# EAGLE schematic usb_tester_OLED_128x64 (EAGLE 6.5.0)
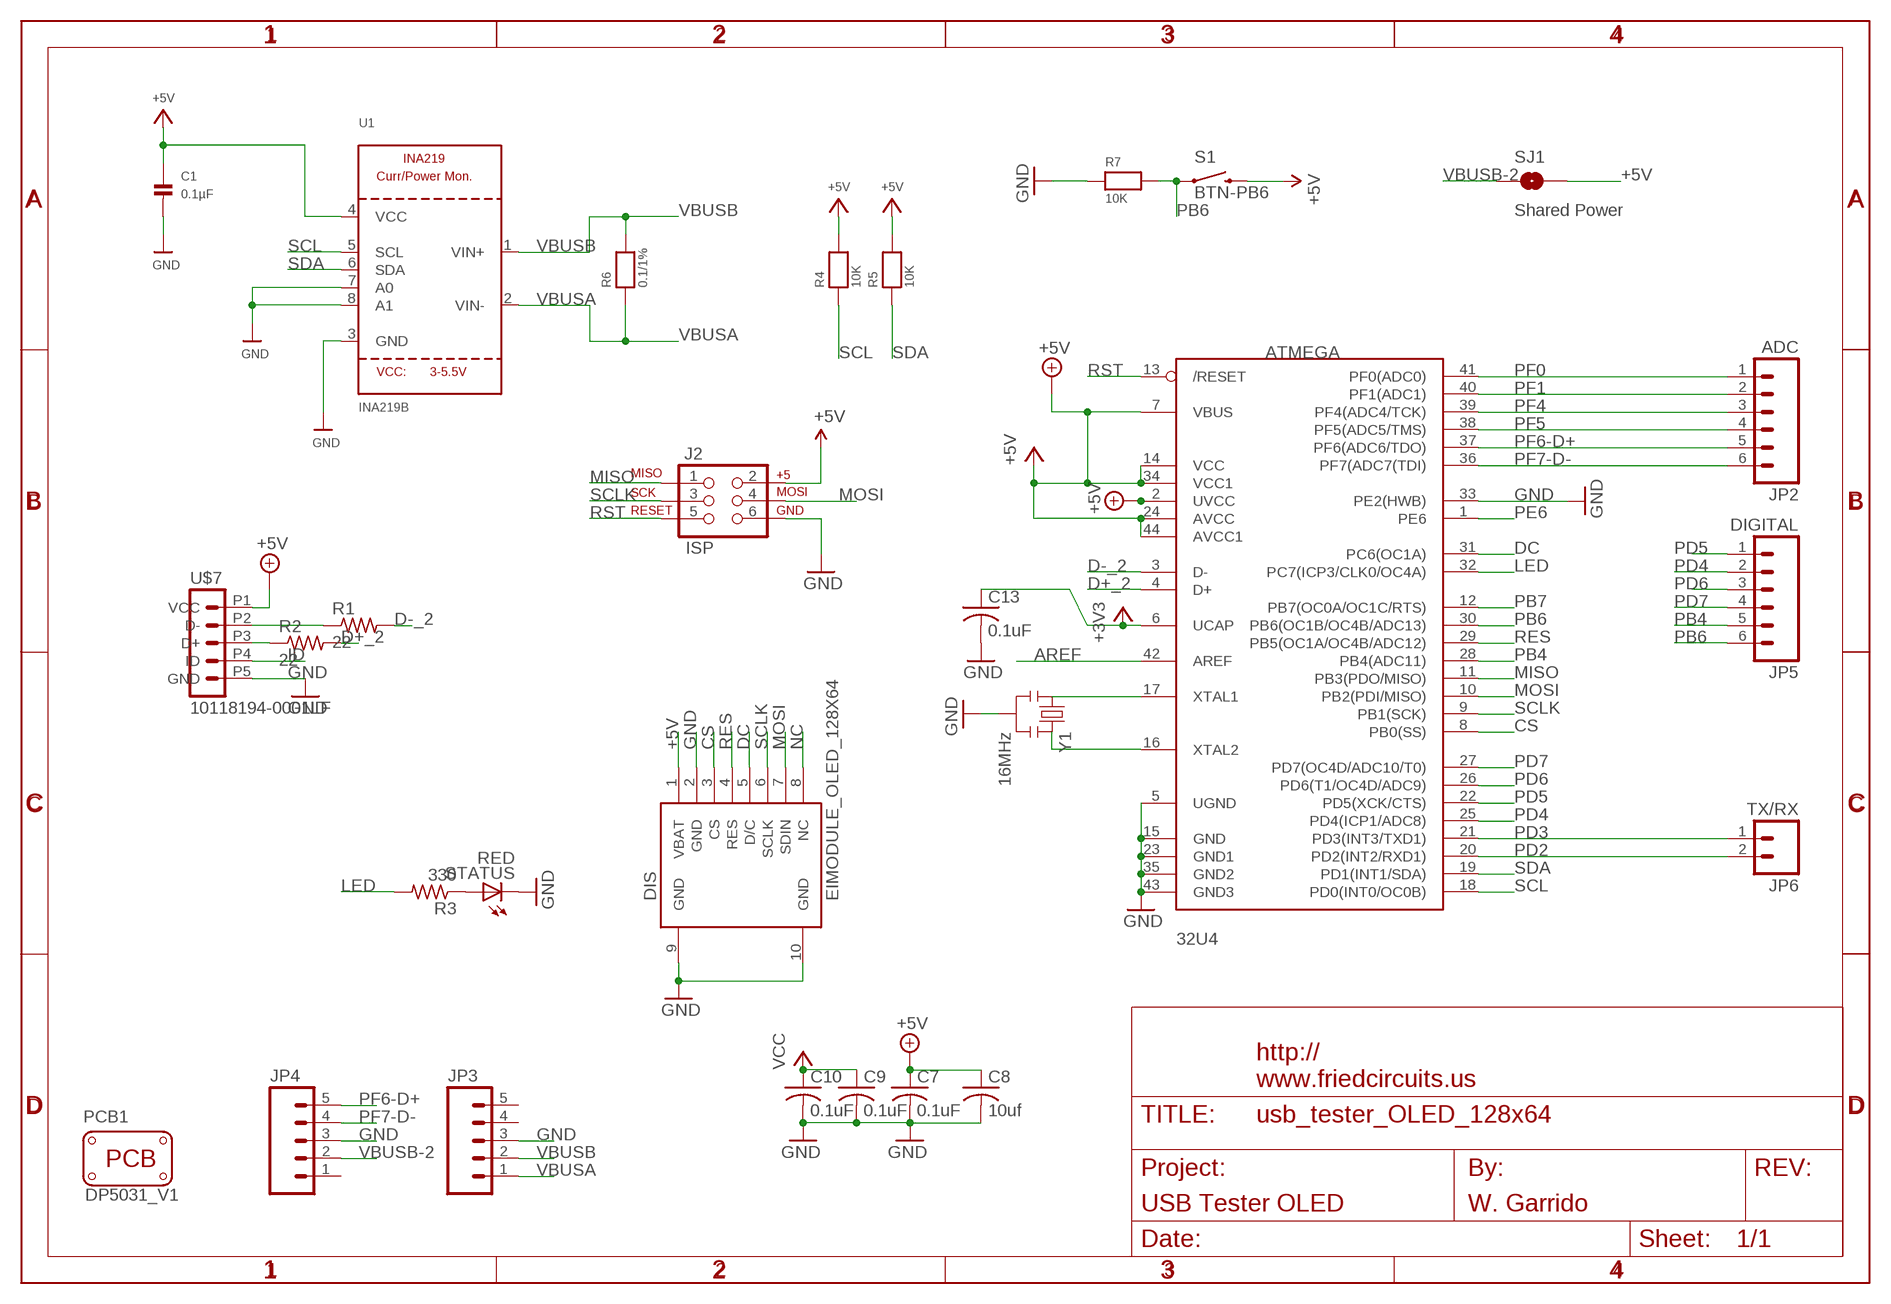
[diagram p0: schematic, sheet 1]

## Parts
32U4  ATMEGA  ATMEGA32U4-AU  [TQFP44]
C1  0.1µF  CAP_CERAMIC0805  [0805]
C7  0.1uF  C-USC0805K  [C0805K]
C8  10uf  C-USC0805K  [C0805K]
C9  0.1uF  C-USC0805K  [C0805K]
C10  0.1uF  C-USC0805K  [C0805K]
C13  0.1uF  C-USC0805K  [C0805K]
DIS  EIMODULE_OLED_128X64  [EIMODULE_OLED_128X64]
J2  ISP  AVR_SPI_PRG_62X3_LOCK  [2X3_LOCK]
JP2  ADC  M06LOCK  [1X06_LOCK]
JP3  M05LOCK  [1X05_LOCK]
JP4  M05LOCK  [1X05_LOCK]
JP5  DIGITAL  M06LOCK  [1X06_LOCK]
JP6  TX/RX  M02LOCK  [1X02_LOCK]
PCB1  PCB_DP_RECTANGLE-31X50  [DP5031_V1]
R1  22  R-US_R0805  [R0805]
R2  22  R-US_R0805  [R0805]
R3  330  R-US_R0805  [R0805]
R4  10K  RESISTOR0805  [0805]
R5  10K  RESISTOR0805  [0805]
R6  0.1/1%  RESISTOR2512  [2512]
R7  10K  RESISTOR0805  [0805]
S1  BTN-PB6  SWITCH-MOMENTARY-2SMD  [TACTILE_SWITCH_SMD]
SJ1  Shared Power  SOLDERJUMPERT-TRACE  [SJ_2S-THICK]
STATUS  RED  LEDCHIPLED_0805  [CHIPLED_0805]
U1  INA219B  INA219  [SOT23-8]
U$1  FRAME_DINA4_L  [FC_CREDIT]
U$7  10118194-0001LF  [10118194-0001LF]
Y1  16MHz  RESONATOR16MHZ  [RESONATOR-SMD]

## Nets
+3V3 [+3V3]: 32U4.6(UCAP) C13.1
+5V [+5V]: 32U4.2(UVCC) 32U4.7(VBUS) 32U4.14(VCC) 32U4.24(AVCC) 32U4.34(VCC1) 32U4.44(AVCC1) C1.1 C7.1 C8.1 C9.1 C10.1 DIS.1(VBAT) J2.2 R4.2 R5.2 S1.3 SJ1.2 U1.4(VCC) U$7.P1(VCC) ; supply symbol labelled VCC
AREF: 32U4.42(AREF)
CS: 32U4.8(PB0(SS)) DIS.3(CS)
D+_2: 32U4.4(D+) R2.2
D-_2: 32U4.3(D-) R1.2
DC: 32U4.31(PC6(OC1A)) DIS.5(D/C)
GND: 32U4.5(UGND) 32U4.15(GND) 32U4.23(GND1) 32U4.33(PE2(HWB)) 32U4.35(GND2) 32U4.43(GND3) C1.2 C7.2 C8.2 C9.2 C10.2 C13.2 DIS.2(GND) DIS.9(GND) DIS.10(GND) J2.6 JP3.3 JP4.3 R7.1 STATUS.C U1.3(GND) U1.7(A0) U1.8(A1) U$7.P5(GND) Y1.2
ID: U$7.P4(ID)
LED: 32U4.32(PC7(ICP3/CLK0/OC4A)) R3.2
MISO: 32U4.11(PB3(PDO/MISO)) J2.1
MOSI: 32U4.10(PB2(PDI/MISO)) DIS.7(SDIN) J2.4
N$1: R3.1 STATUS.A
N$2: R1.1 U$7.P2(D-)
N$3: R2.1 U$7.P3(D+)
N$8: 32U4.17(XTAL1) Y1.1
N$9: 32U4.16(XTAL2) Y1.3
NC: DIS.8(NC)
PB4: 32U4.28(PB4(ADC11)) JP5.5
PB6: 32U4.30(PB6(OC1B/OC4B/ADC13)) JP5.6 R7.2 S1.1
PB7: 32U4.12(PB7(OC0A/OC1C/RTS))
PD2: 32U4.20(PD2(INT2/RXD1)) JP6.2
PD3: 32U4.21(PD3(INT3/TXD1)) JP6.1
PD4: 32U4.25(PD4(ICP1/ADC8)) JP5.2
PD5: 32U4.22(PD5(XCK/CTS)) JP5.1
PD6: 32U4.26(PD6(T1/OC4D/ADC9)) JP5.3
PD7: 32U4.27(PD7(OC4D/ADC10/T0)) JP5.4
PE6: 32U4.1(PE6)
PF0: 32U4.41(PF0(ADC0)) JP2.1
PF1: 32U4.40(PF1(ADC1)) JP2.2
PF4: 32U4.39(PF4(ADC4/TCK)) JP2.3
PF5: 32U4.38(PF5(ADC5/TMS)) JP2.4
PF6-D+: 32U4.37(PF6(ADC6/TDO)) JP2.5 JP4.5
PF7-D-: 32U4.36(PF7(ADC7(TDI)) JP2.6 JP4.4
RES: 32U4.29(PB5(OC1A/OC4B/ADC12)) DIS.4(RES)
RST: 32U4.13(/RESET) J2.5
SCL: 32U4.18(PD0(INT0/OC0B)) R4.1 U1.5(SCL)
SCLK: 32U4.9(PB1(SCK)) DIS.6(SCLK) J2.3
SDA: 32U4.19(PD1(INT1/SDA)) R5.1 U1.6(SDA)
VBUSA [VBUS]: JP3.1 R6.1 U1.2(VIN-)
VBUSB [VBUS]: JP3.2 R6.2 U1.1(VIN+)
VBUSB-2 [VCC]: JP4.2 SJ1.1
Unconnected: JP3.4 JP3.5 JP4.1

## Library data of the parts
32U4 = adafruit:ATMEGA32U4: http://www.ladyada.net/library/eagle
C1 = microbuilder:CAP_CERAMIC: Ceramic Capacitors 0402 - 0402 Surface Mount Capacitors 16pF 50V 5% [Digikey: 445-4899-2-ND] 18pF 50V 5% [Digikey: 490-1281-2-ND] 22pF 50V 5% [Digikey: 490-1283-2-ND] 68pF 50V 5% [Digikey: 490-1289-2-ND] 0.1uF 10V 10% [Digikey: 490-1318-2-ND] 1.0uF 6.3V 10% [Digikey: 490-1320-2-ND] 0603 - 0603 Surface Mount Capacitors 16 pF 50V 5% [Digikey: 445-5051-2-ND] 22 pF 50V [Digikey: PCC220ACVTR-ND] 33 pF 50V 5% [Digikey: 490-1415-1-ND] 56pF 50V 5% [Digikey: 490-1421-1-ND] 220pF 50V 5% [Digikey: 445-1285-1-ND] 680 pF 50V 2200 pF 50V 5% C0G [Digikey: 445-1297-1-ND] 5600 pF 100V 5% X7R [Digikey: 478-3711-1-ND] 0.1 µF 25V 10% [Digikey: PCC2277TR-ND] 0.22 µF 16V 10% X7R [Digikey: 445-1318-1-ND] 1.0 µF 25V 10% [Digikey: 445-5146-2-ND] 0603 - RF Specific 3pF 250V +/-0.1pF RF [Digikey: 712-1347-1-ND] 18 pF 250V 5% [Digikey: 478-3505-1-ND or 712-1322-1-ND] 56 pF 250V 5% C0G RF [Digikey: 490-4867-1-ND] 68 pF 250V RF [Digikey: 490-4868-1-ND] 0805 - 0805 Surface Mount Capacitors 220 pF 250V 2% RF Ceramic Capacitor [Digikey: 712-1398-1-ND] 1000 pF 50V 2% NP0 Ceramic Capacitor [Digikey: 478-3760-1-ND] 0.1 µF 25V 10% Ceramic Capacitor [Digikey: PCC1828TR-ND] 1.0 µF 16V 10% Ceramic Capacitor[Digikey: 490-1691-2-ND] 10.0 µF 10V 10% Ceramic Capacitor[Digikey: 709-1228-1-ND] 10.0 uF 16V 10% Ceramic Capacitor [Digikey: 478-5165-2-ND] 47 uF 6.3V 20% Ceramic Capacitor [Digikey: 587-1779-1-ND or 399-5506-1-ND] 1206 - 1206 Surface Mount Capacitors 47uF 10V 20% Ceramic Capacitor [Digikey: 490-5528-1-ND or 399-5508-1-ND or 445-6010-1-ND] 100uF 6.3V -20%, +80% Y5V Ceramic Capacitor (Digikey: 490-4512-1-ND, Mouser: 81-GRM31CF50J107ZE1L)
C7-C10 C13 = adafruit:C-US: CAPACITOR, American symbol
DIS = FriedCircuits:EIMODULE_OLED_128X64
J2 = SparkFun-Connectors:AVR_SPI_PRG_6: AVR ISP 6 Pin This is the reduced ISP connector for AVR programming. Common on Arduino. This footprint will take up less PCB space and can be used with a 10-pin to 6-pin adapter such as SKU: BOB-08508
JP2 JP5 = SparkFun-Connectors:M06: Header 6 Standard 6-pin 0.1" header. Use with straight break away headers (SKU : PRT-00116), right angle break away headers (PRT-00553), swiss pins (PRT-00743), machine pins (PRT-00117), and female headers (PRT-00115). Molex polarized connector foot print use with SKU : PRT-08094 with associated crimp pins and housings. NOTES ON THE VARIANTS LOCK and LOCK_LONGPADS... This footprint was designed to help hold the alignment of a through-hole component (i.e. 6-pin header) while soldering it into place. You may notice that each hole has been shifted either up or down by 0.005 of an inch from it's more standard position (which is a perfectly straight line). This slight alteration caused the pins (the squares in the middle) to touch the edges of the holes. Because they are alternating, it causes a "brace" to hold the component in place. 0.005 has proven to be the perfect amount of "off-center" position when using our standard breakaway headers. Although looks a little odd when you look at the bare footprint, once you have a header in there, the alteration is very hard to notice. Also,if you push a header all the way into place, it is covered up entirely on the bottom side. This idea of altering the position of holes to aid alignment will be further integrated into the Sparkfun Library for other footprints. It can help hold any component with 3 or more connection pins.
JP3 JP4 = SparkFun-Connectors:M05: Header 5 Standard 5-pin 0.1" header. Use with straight break away headers (SKU : PRT-00116), right angle break away headers (PRT-00553), swiss pins (PRT-00743), machine pins (PRT-00117), and female headers (PRT-00115). Molex polarized connector foot print use with SKU : PRT-08230 with associated crimp pins and housings.
JP6 = SparkFun-Connectors:M02: Standard 2-pin 0.1" header. Use with - straight break away headers ( PRT-00116) - right angle break away headers (PRT-00553) - swiss pins (PRT-00743) - machine pins (PRT-00117) - female headers (PRT-00115) Molex polarized connector foot print use with: PRT-08233 with associated crimp pins and housings. 2.54_SCREWTERM for use with PRT-10571. 3.5mm Screw Terminal footprints for PRT-08084 5mm Screw Terminal footprints for use with PRT-08433
PCB1 = dp_devices:PCB_DP_RECTANGLE: Dangerous Prototypes Standard Rectangular PCB sizes; PCB_SIZE: DP5031_V1
R1-R3 = adafruit:R-US_: RESISTOR, American symbol
R4-R7 = microbuilder:RESISTOR: Resistors 0402 - 0402 Surface Mount Package 22 Ohm 1% 1/16W [Digikey: 311-22.0LRTR-ND] 33 Ohm 5% 1/16W 1.0K 5% 1/16W 1.5K 5% 1/16W 2.0K 1% 1/16W 10.0K 1% 1/16W [Digikey: 311-10.0KLRTR-ND] 10.0K 5% 1/16W [Digikey: RMCF0402JT10K0TR-ND] 12.1K 1% 1/16W [Digikey: 311-22.0LRTR-ND] 100.0K 5% 1/16W 0603 - 0603 Surface Mount Package 0 Ohm 1/10 Watt 1% Resistor 15 Ohm 1/10 Watt 1% Resistor 33 Ohm 1/10 Watt 1% Resistor 49.9 Ohm 1/10 Watt 1% Resistor 100 Ohm 1/10 Watt 1% Resistor 150 Ohm 1/10 Watt 1% Resistor 240 Ohm 1/10 Watt 1% Resistor 390 Ohm 1/10 Watt 1% Resistor 560 Ohm 1/10 Watt 1% Resistor 680 Ohm 1/10 Watt 1% Resistor 750 Ohm 1/10 Watt 1% Resistor 1.0K Ohm 1/10 Watt 1% Resistor 1.5K Ohm 1/10 Watt 1% Resistor 2.0K Ohm 1/10 Watt 1% Resistor 2.2K Ohm 1/10 Watt 1% Resistor 3.3K Ohm 1/10 Watt 1% Resistor 4.7K Ohm 1/10 Watt 1% Resistor 10.0K Ohm 1/10 Watt 1% Resistor 12.0K Ohm 1/10 Watt 1% Resistor 12.1K Ohm 1/10 Watt 1% Resistor 20.0K Ohm 1/10 Watt 1% Resistor 33.0K Ohm 1/10 Watt 1% Resistor 100.0K Ohm 1/10 Watt 1% Resistor 0805 - 0805 Surface Mount Package 0 Ohm 1/8 Watt 1% Resistor 33 Ohm 1/8 Watt 1% Resistor 100 Ohm 1/8 Watt 1% Resistor 150 Ohm 1/8 Watt 1% Resistor 200 Ohm 1/8 Watt 1% Resistor 240 Ohm 1/8 Watt 1% Resistor 330 Ohm 1/8 Watt 1% Resistor 390 Ohm 1/8 Watt 1% Resistor 470 Ohm 1/8 Watt 1% Resistor 1.0K Ohm 1/8 Watt 1% Resistor 1.5K Ohm 1/8 Watt 1% Resistor 2.0K Ohm 1/8 Watt 1% Resistor 4.7K Ohm 1/8 Watt 1% Resistor 5.1K Ohm 1/8 Watt 1% Resistor 5.6K Ohm 1/8 Watt 1% Resistor 10.0K Ohm 1/8 Watt 1% Resistor 22.0K Ohm 1/8 Watt 1% Resistor 33.0K Ohm 1/8 Watt 1% Resistor 100K Ohm 1/8 Watt 1% Resistor 1206 - 1206 Surface Mount Package 2012 - 2010 Surface Mount Package 0.11 Ohm 1/2 Watt 1% Resistor - Digikey: RHM.11UCT-ND
S1 = SparkFun-Electromechanical:SWITCH-MOMENTARY-2: Various NO switches- pushbuttons, reed, etc
SJ1 = FriedCircuits:SOLDERJUMPER: Solder Jumper Standard SMD solder jumper. Used to automate production. Two varients : Normally Open and Normally Closed are the same, but have different paste layers. NC will have a large amount of paste and should jumper during reflow.
STATUS = adafruit:LED: LED OSRAM: - CHIPLED LG R971, LG N971, LY N971, LG Q971, LY Q971, LO R971, LY R971 LH N974, LH R974 LS Q976, LO Q976, LY Q976 LO Q996 - Hyper CHIPLED LW Q18S LB Q993, LB Q99A, LB R99A - SideLED LS A670, LO A670, LY A670, LG A670, LP A670 LB A673, LV A673, LT A673, LW A673 LH A674 LY A675 LS A676, LA A676, LO A676, LY A676, LW A676 LS A679, LY A679, LG A679 - Hyper Micro SIDELED® LS Y876, LA Y876, LO Y876, LY Y876 LT Y87S - SmartLED LW L88C, LW L88S LB L89C, LB L89S, LG L890 LS L89K, LO L89K, LY L89K LS L896, LA L896, LO L896, LY L896 - TOPLED LS T670, LO T670, LY T670, LG T670, LP T670 LSG T670, LSP T670, LSY T670, LOP T670, LYG T670 LG T671, LOG T671, LSG T671 LB T673, LV T673, LT T673, LW T673 LH T674 LS T676, LA T676, LO T676, LY T676, LB T676, LH T676, LSB T676, LW T676 LB T67C, LV T67C, LT T67C, LS T67K, LO T67K, LY T67K, LW E67C LS E67B, LA E67B, LO E67B, LY E67B, LB E67C, LV E67C, LT E67C LW T67C LS T679, LY T679, LG T679 LS T770, LO T770, LY T770, LG T770, LP T770 LB T773, LV T773, LT T773, LW T773 LH T774 LS E675, LA E675, LY E675, LS T675 LS T776, LA T776, LO T776, LY T776, LB T776 LHGB T686 LT T68C, LB T68C - Hyper Mini TOPLED® LB M676 - Mini TOPLED Santana® LG M470 LS M47K, LO M47K, LY M47K Source: http://www.osram.convergy.de/
U1 = microbuilder:INA219: INA219 - I2C Current/Power Monitor Voltage Range: 0-26V Accuracy: 0.5% Temperature: -40°C - 125°C
U$1 = FriedCircuits:FRAME_DINA4_L: A4 FC frame Standard FriedCircuits schematic frame. Automagically adds the standard texts to the PCB Use the atrribute in the schematic editor to change the fields.; AUTHOR: W. Garrido; FF2: FriedCircuits; FF3: www.friedcircuits.us; PROJECT: USB Tester OLED; URL1: http://; URL2: www.friedcircuits.us
U$7 = FriedCircuits:10118194-0001LF: Thanks to Leon Marure for this footprint https://mywebspace.wisc.edu/lnmaurer/web/FloatingAway/FloatingAway.html leon.maurer@gmail.com https://mywebspace.wisc.edu/lnmaurer/web/ Friedcircuits - Added ID pin to schamtic.
Y1 = SparkFun-FreqCtrl:RESONATOR: Resonator Small SMD resonator. Used, eg, on the Arduino Pro/ Pro Mini boards. 8MHz- XTAL-08895 16MHz- XTAL-08900; PROD_ID: XTAL-08900

## Net classes
0 default: width 0.254 mm, drill 0.254 mm
1 VCC: width 0.254 mm, drill 0.254 mm
2 VBUS: width 0.406 mm, drill 0.254 mm
3 +5V: width 0.254 mm, drill 0.254 mm
4 +3V3: width 0.254 mm, drill 0.254 mm